# Altium schematic sheet cpu_io.SchDoc: CPU I/O and Configuration
size B; Engineer: Michael J. Kelly; Organization: CSB540otn - Outernet; Address1: AM335x Compute Board; Address2: (C) 2015; Address3: See us on the Web:; Address4: http://outernet.is; DocumentNumber: 4; Revision: V1.0; SheetNumber: 4; SheetTotal: 9
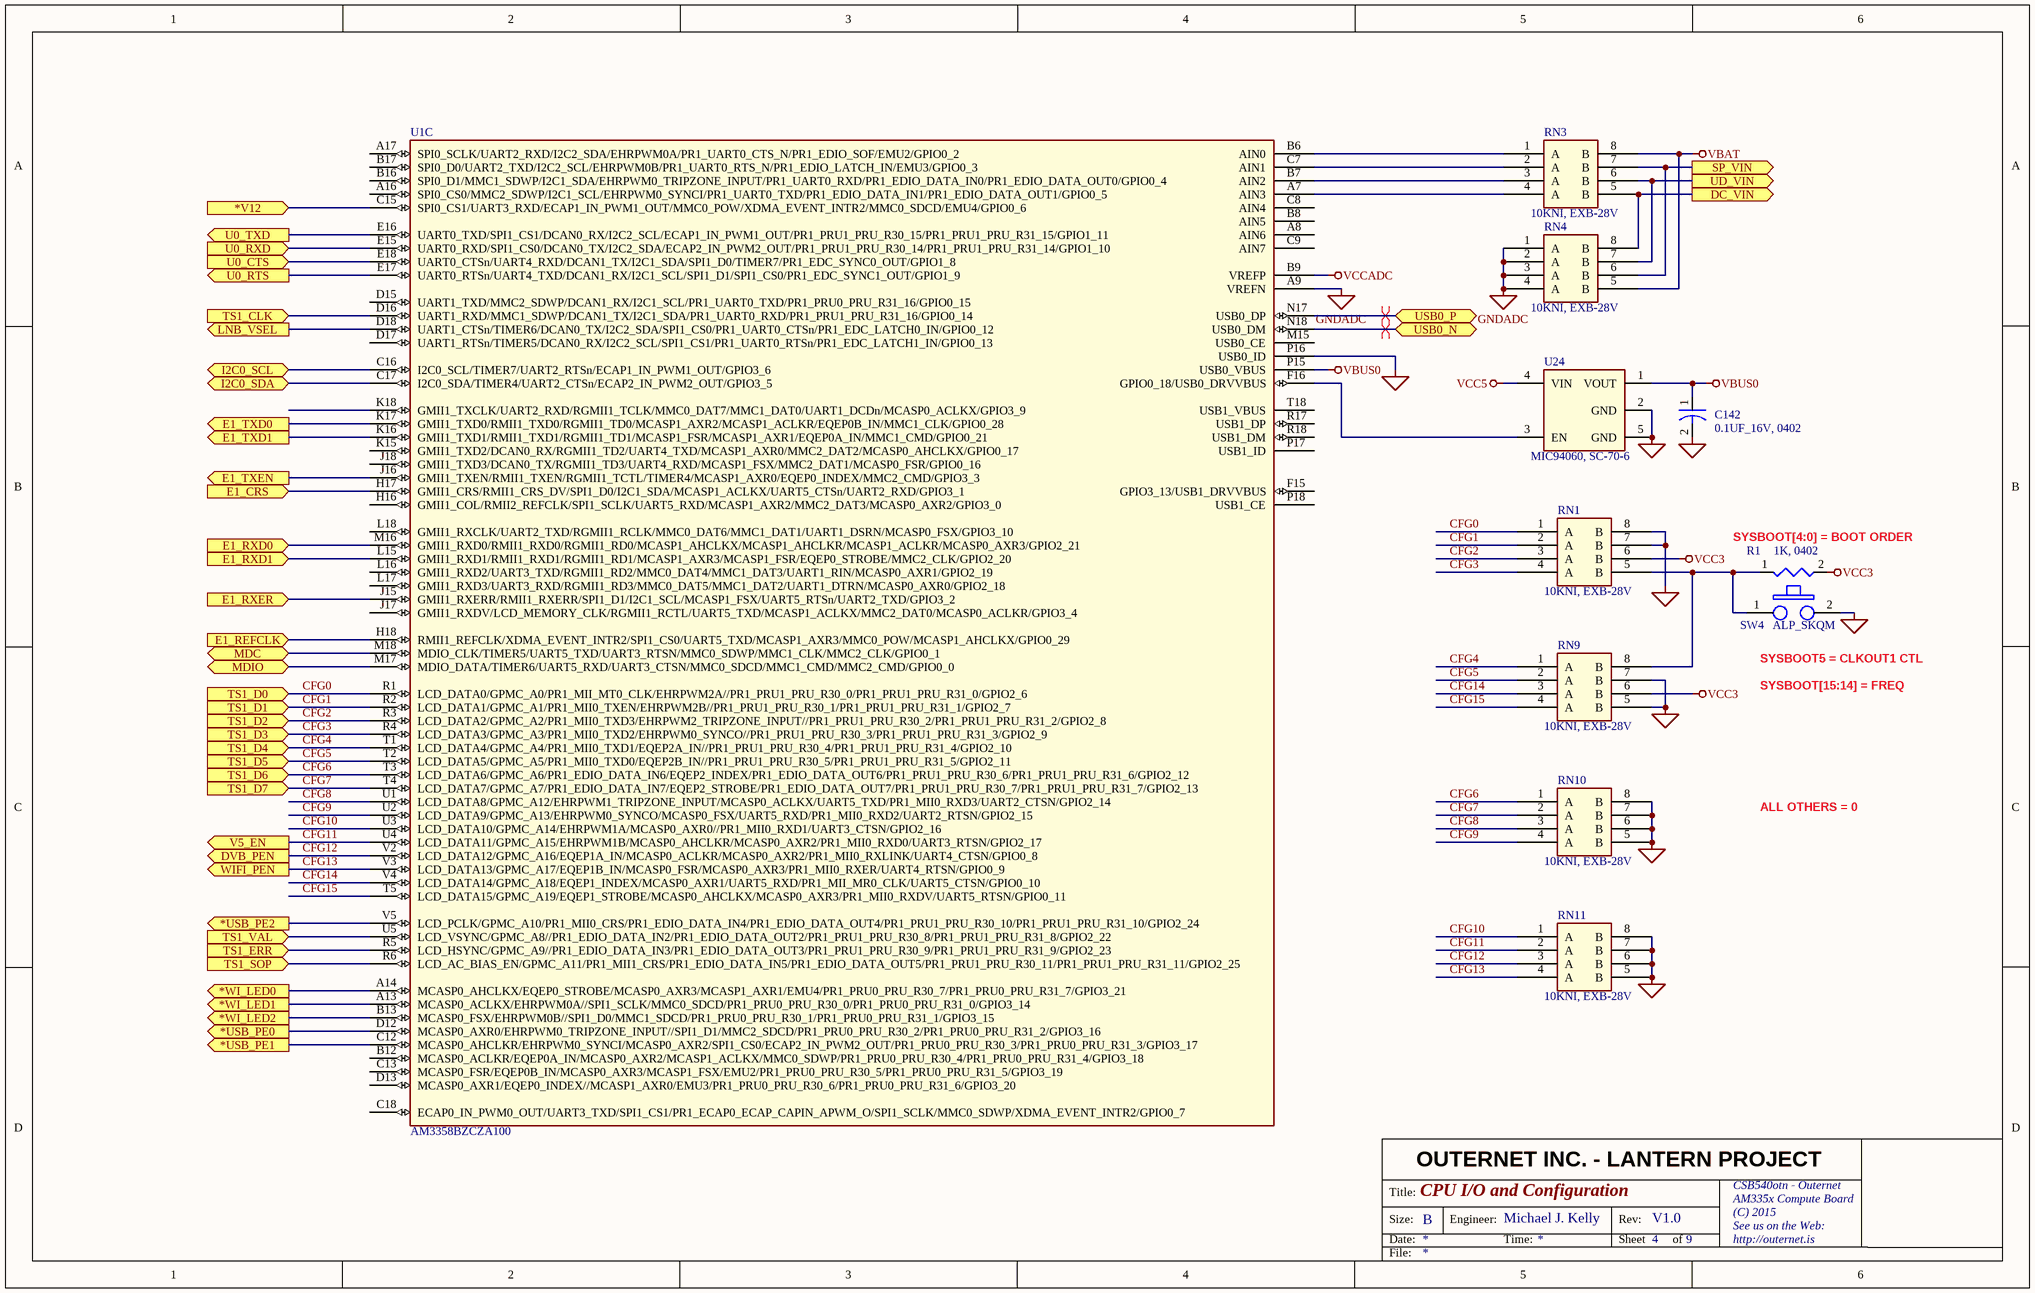
[diagram p0: cpu_io.SchDoc]

## Parts
C142  0.1UF_16V, 0402  [0402C]
R1  1K, 0402  [0402R]
RN1  10KNI, EXB-28V  [EXB-28V]
RN3  10KNI, EXB-28V  [EXB-28V]
RN4  10KNI, EXB-28V  [EXB-28V]
RN9  10KNI, EXB-28V  [EXB-28V]
RN10  10KNI, EXB-28V  [EXB-28V]
RN11  10KNI, EXB-28V  [EXB-28V]
SW4  ALP_SKQM  [ALPS_SKQM]
U1  AM3358BZCZA100  [BGA324x18]  (part C of 4)
U24  MIC94060, SC-70-6  [SOT-363/SC-70-6]

## Ports
*USB_PE0 (out), *USB_PE1 (out), *USB_PE2 (out), *V12 (in), *WI_LED0 (out), *WI_LED1 (out), *WI_LED2 (out), DC_VIN (out), DVB_PEN (out), E1_CRS (in), E1_REFCLK (in), E1_RXD0 (in), E1_RXD1 (in), E1_RXER (in), E1_TXD0 (out), E1_TXD1 (out), E1_TXEN (out), I2C0_SCL (bidir), I2C0_SDA (bidir), LNB_VSEL (out), MDC (bidir), MDIO (bidir), SP_VIN (out), TS1_CLK (in), TS1_D0 (in), TS1_D1 (in), TS1_D2 (in), TS1_D3 (in), TS1_D4 (in), TS1_D5 (in), TS1_D6 (in), TS1_D7 (in), TS1_ERR (in), TS1_SOP (in), TS1_VAL (in), U0_CTS (in), U0_RTS (out), U0_RXD (in), U0_TXD (out), UD_VIN (out), USB0_N (bidir), USB0_P (bidir), V5_EN (out), WIFI_PEN (out)

## Nets
GND: C142.2 RN1.7(B) RN1.8(B) RN9.5(B) RN9.7(B) RN10.5(B) RN10.6(B) RN10.7(B) RN10.8(B) RN11.5(B) RN11.6(B) RN11.7(B) RN11.8(B) SW4.2 U1.P16(USB0_ID) U24.2(GND) U24.5(GND)
GNDADC: RN4.1(A) RN4.2(A) RN4.3(A) RN4.4(A) U1.A9(VREFN)
VBAT: RN3.8(B) RN4.5(B)
VBUS0: C142.1 U1.P15(USB0_VBUS) U24.1(VOUT)
VCC3: R1.2 RN1.6(B) RN9.6(B)
VCC5: U24.4(VIN)
VCCADC: U1.B9(VREFP)
*USB_PE0: U1.D12(MCASP0_AXR0/EHRPWM0_TRIPZONE_INPUT//SPI1_D1/MMC2_SDCD/PR1_PRU0_PRU_R30_2/PR1_PRU0_PRU_R31_2/GPIO3_16) ; port *USB_PE0
*USB_PE1: U1.C12(MCASP0_AHCLKR/EHRPWM0_SYNCI/MCASP0_AXR2/SPI1_CS0/ECAP2_IN_PWM2_OUT/PR1_PRU0_PRU_R30_3/PR1_PRU0_PRU_R31_3/GPIO3_17) ; port *USB_PE1
*USB_PE2: U1.V5(LCD_PCLK/GPMC_A10/PR1_MII0_CRS/PR1_EDIO_DATA_IN4/PR1_EDIO_DATA_OUT4/PR1_PRU1_PRU_R30_10/PR1_PRU1_PRU_R31_10/GPIO2_24) ; port *USB_PE2
*V12: U1.C15(SPI0_CS1/UART3_RXD/ECAP1_IN_PWM1_OUT/MMC0_POW/XDMA_EVENT_INTR2/MMC0_SDCD/EMU4/GPIO0_6) ; port *V12
*WI_LED0: U1.A14(MCASP0_AHCLKX/EQEP0_STROBE/MCASP0_AXR3/MCASP1_AXR1/EMU4/PR1_PRU0_PRU_R30_7/PR1_PRU0_PRU_R31_7/GPIO3_21) ; port *WI_LED0
*WI_LED1: U1.A13(MCASP0_ACLKX/EHRPWM0A//SPI1_SCLK/MMC0_SDCD/PR1_PRU0_PRU_R30_0/PR1_PRU0_PRU_R31_0/GPIO3_14) ; port *WI_LED1
*WI_LED2: U1.B13(MCASP0_FSX/EHRPWM0B//SPI1_D0/MMC1_SDCD/PR1_PRU0_PRU_R30_1/PR1_PRU0_PRU_R31_1/GPIO3_15) ; port *WI_LED2
CFG0: RN1.1(A) U1.R1(LCD_DATA0/GPMC_A0/PR1_MII_MT0_CLK/EHRPWM2A//PR1_PRU1_PRU_R30_0/PR1_PRU1_PRU_R31_0/GPIO2_6) ; port TS1_D0
CFG1: RN1.2(A) U1.R2(LCD_DATA1/GPMC_A1/PR1_MII0_TXEN/EHRPWM2B//PR1_PRU1_PRU_R30_1/PR1_PRU1_PRU_R31_1/GPIO2_7) ; port TS1_D1
CFG2: RN1.3(A) U1.R3(LCD_DATA2/GPMC_A2/PR1_MII0_TXD3/EHRPWM2_TRIPZONE_INPUT//PR1_PRU1_PRU_R30_2/PR1_PRU1_PRU_R31_2/GPIO2_8) ; port TS1_D2
CFG3: RN1.4(A) U1.R4(LCD_DATA3/GPMC_A3/PR1_MII0_TXD2/EHRPWM0_SYNCO//PR1_PRU1_PRU_R30_3/PR1_PRU1_PRU_R31_3/GPIO2_9) ; port TS1_D3
CFG4: RN9.1(A) U1.T1(LCD_DATA4/GPMC_A4/PR1_MII0_TXD1/EQEP2A_IN//PR1_PRU1_PRU_R30_4/PR1_PRU1_PRU_R31_4/GPIO2_10) ; port TS1_D4
CFG5: RN9.2(A) U1.T2(LCD_DATA5/GPMC_A5/PR1_MII0_TXD0/EQEP2B_IN//PR1_PRU1_PRU_R30_5/PR1_PRU1_PRU_R31_5/GPIO2_11) ; port TS1_D5
CFG6: RN10.1(A) U1.T3(LCD_DATA6/GPMC_A6/PR1_EDIO_DATA_IN6/EQEP2_INDEX/PR1_EDIO_DATA_OUT6/PR1_PRU1_PRU_R30_6/PR1_PRU1_PRU_R31_6/GPIO2_12) ; port TS1_D6
CFG7: RN10.2(A) U1.T4(LCD_DATA7/GPMC_A7/PR1_EDIO_DATA_IN7/EQEP2_STROBE/PR1_EDIO_DATA_OUT7/PR1_PRU1_PRU_R30_7/PR1_PRU1_PRU_R31_7/GPIO2_13) ; port TS1_D7
CFG8: RN10.3(A) U1.U1(LCD_DATA8/GPMC_A12/EHRPWM1_TRIPZONE_INPUT/MCASP0_ACLKX/UART5_TXD/PR1_MII0_RXD3/UART2_CTSN/GPIO2_14)
CFG9: RN10.4(A) U1.U2(LCD_DATA9/GPMC_A13/EHRPWM0_SYNCO/MCASP0_FSX/UART5_RXD/PR1_MII0_RXD2/UART2_RTSN/GPIO2_15)
CFG10: RN11.1(A) U1.U3(LCD_DATA10/GPMC_A14/EHRPWM1A/MCASP0_AXR0//PR1_MII0_RXD1/UART3_CTSN/GPIO2_16)
CFG11: RN11.2(A) U1.U4(LCD_DATA11/GPMC_A15/EHRPWM1B/MCASP0_AHCLKR/MCASP0_AXR2/PR1_MII0_RXD0/UART3_RTSN/GPIO2_17) ; port V5_EN
CFG12: RN11.3(A) U1.V2(LCD_DATA12/GPMC_A16/EQEP1A_IN/MCASP0_ACLKR/MCASP0_AXR2/PR1_MII0_RXLINK/UART4_CTSN/GPIO0_8) ; port DVB_PEN
CFG13: RN11.4(A) U1.V3(LCD_DATA13/GPMC_A17/EQEP1B_IN/MCASP0_FSR/MCASP0_AXR3/PR1_MII0_RXER/UART4_RTSN/GPIO0_9) ; port WIFI_PEN
CFG14: RN9.3(A) U1.V4(LCD_DATA14/GPMC_A18/EQEP1_INDEX/MCASP0_AXR1/UART5_RXD/PR1_MII_MR0_CLK/UART5_CTSN/GPIO0_10)
CFG15: RN9.4(A) U1.T5(LCD_DATA15/GPMC_A19/EQEP1_STROBE/MCASP0_AHCLKX/MCASP0_AXR3/PR1_MII0_RXDV/UART5_RTSN/GPIO0_11)
DC_VIN: RN3.5(B) RN4.8(B) ; port DC_VIN
E1_CRS: U1.H17(GMII1_CRS/RMII1_CRS_DV/SPI1_D0/I2C1_SDA/MCASP1_ACLKX/UART5_CTSn/UART2_RXD/GPIO3_1) ; port E1_CRS
E1_REFCLK: U1.H18(RMII1_REFCLK/XDMA_EVENT_INTR2/SPI1_CS0/UART5_TXD/MCASP1_AXR3/MMC0_POW/MCASP1_AHCLKX/GPIO0_29) ; port E1_REFCLK
E1_RXD0: U1.M16(GMII1_RXD0/RMII1_RXD0/RGMII1_RD0/MCASP1_AHCLKX/MCASP1_AHCLKR/MCASP1_ACLKR/MCASP0_AXR3/GPIO2_21) ; port E1_RXD0
E1_RXD1: U1.L15(GMII1_RXD1/RMII1_RXD1/RGMII1_RD1/MCASP1_AXR3/MCASP1_FSR/EQEP0_STROBE/MMC2_CLK/GPIO2_20) ; port E1_RXD1
E1_RXER: U1.J15(GMII1_RXERR/RMII1_RXERR/SPI1_D1/I2C1_SCL/MCASP1_FSX/UART5_RTSn/UART2_TXD/GPIO3_2) ; port E1_RXER
E1_TXD0: U1.K17(GMII1_TXD0/RMII1_TXD0/RGMII1_TD0/MCASP1_AXR2/MCASP1_ACLKR/EQEP0B_IN/MMC1_CLK/GPIO0_28) ; port E1_TXD0
E1_TXD1: U1.K16(GMII1_TXD1/RMII1_TXD1/RGMII1_TD1/MCASP1_FSR/MCASP1_AXR1/EQEP0A_IN/MMC1_CMD/GPIO0_21) ; port E1_TXD1
E1_TXEN: U1.J16(GMII1_TXEN/RMII1_TXEN/RGMII1_TCTL/TIMER4/MCASP1_AXR0/EQEP0_INDEX/MMC2_CMD/GPIO3_3) ; port E1_TXEN
I2C0_SCL: U1.C16(I2C0_SCL/TIMER7/UART2_RTSn/ECAP1_IN_PWM1_OUT/GPIO3_6) ; port I2C0_SCL
I2C0_SDA: U1.C17(I2C0_SDA/TIMER4/UART2_CTSn/ECAP2_IN_PWM2_OUT/GPIO3_5) ; port I2C0_SDA
LNB_VSEL: U1.D18(UART1_CTSn/TIMER6/DCAN0_TX/I2C2_SDA/SPI1_CS0/PR1_UART0_CTSn/PR1_EDC_LATCH0_IN/GPIO0_12) ; port LNB_VSEL
MDC: U1.M18(MDIO_CLK/TIMER5/UART5_TXD/UART3_RTSN/MMC0_SDWP/MMC1_CLK/MMC2_CLK/GPIO0_1) ; port MDC
MDIO: U1.M17(MDIO_DATA/TIMER6/UART5_RXD/UART3_CTSN/MMC0_SDCD/MMC1_CMD/MMC2_CMD/GPIO0_0) ; port MDIO
SP_VIN: RN3.7(B) RN4.6(B) ; port SP_VIN
TS1_CLK: U1.D16(UART1_RXD/MMC1_SDWP/DCAN1_TX/I2C1_SDA/PR1_UART0_RXD/PR1_PRU1_PRU_R31_16/GPIO0_14) ; port TS1_CLK
TS1_ERR: U1.R5(LCD_HSYNC/GPMC_A9//PR1_EDIO_DATA_IN3/PR1_EDIO_DATA_OUT3/PR1_PRU1_PRU_R30_9/PR1_PRU1_PRU_R31_9/GPIO2_23) ; port TS1_ERR
TS1_SOP: U1.R6(LCD_AC_BIAS_EN/GPMC_A11/PR1_MII1_CRS/PR1_EDIO_DATA_IN5/PR1_EDIO_DATA_OUT5/PR1_PRU1_PRU_R30_11/PR1_PRU1_PRU_R31_11/GPIO2_25) ; port TS1_SOP
TS1_VAL: U1.U5(LCD_VSYNC/GPMC_A8//PR1_EDIO_DATA_IN2/PR1_EDIO_DATA_OUT2/PR1_PRU1_PRU_R30_8/PR1_PRU1_PRU_R31_8/GPIO2_22) ; port TS1_VAL
U0_CTS: U1.E18(UART0_CTSn/UART4_RXD/DCAN1_TX/I2C1_SDA/SPI1_D0/TIMER7/PR1_EDC_SYNC0_OUT/GPIO1_8) ; port U0_CTS
U0_RTS: U1.E17(UART0_RTSn/UART4_TXD/DCAN1_RX/I2C1_SCL/SPI1_D1/SPI1_CS0/PR1_EDC_SYNC1_OUT/GPIO1_9) ; port U0_RTS
U0_RXD: U1.E15(UART0_RXD/SPI1_CS0/DCAN0_TX/I2C2_SDA/ECAP2_IN_PWM2_OUT/PR1_PRU1_PRU_R30_14/PR1_PRU1_PRU_R31_14/GPIO1_10) ; port U0_RXD
U0_TXD: U1.E16(UART0_TXD/SPI1_CS1/DCAN0_RX/I2C2_SCL/ECAP1_IN_PWM1_OUT/PR1_PRU1_PRU_R30_15/PR1_PRU1_PRU_R31_15/GPIO1_11) ; port U0_TXD
UD_VIN: RN3.6(B) RN4.7(B) ; port UD_VIN
USB0_N: U1.N18(USB0_DM) ; port USB0_N
USB0_P: U1.N17(USB0_DP) ; port USB0_P
NetR1_1: R1.1 RN1.5(B) RN9.8(B) SW4.1
NetRN3_1: RN3.1(A) U1.B6(AIN0)
NetRN3_2: RN3.2(A) U1.C7(AIN1)
NetRN3_3: RN3.3(A) U1.B7(AIN2)
NetRN3_4: RN3.4(A) U1.A7(AIN3)
NetU1_F16: U1.F16(GPIO0_18/USB0_DRVVBUS) U24.3(EN)

Not connected (* = marked no-connect by the designer): U1 A8(AIN6) A16(SPI0_CS0/MMC2_SDWP/I2C1_SCL/EHRPWM0_SYNCI/PR1_UART0_TXD/PR1_EDIO_DATA_IN1/PR1_EDIO_DATA_OUT1/GPIO0_5) A17(SPI0_SCLK/UART2_RXD/I2C2_SDA/EHRPWM0A/PR1_UART0_CTS_N/PR1_EDIO_SOF/EMU2/GPIO0_2) B8(AIN5) B12(MCASP0_ACLKR/EQEP0A_IN/MCASP0_AXR2/MCASP1_ACLKX/MMC0_SDWP/PR1_PRU0_PRU_R30_4/PR1_PRU0_PRU_R31_4/GPIO3_18) B16(SPI0_D1/MMC1_SDWP/I2C1_SDA/EHRPWM0_TRIPZONE_INPUT/PR1_UART0_RXD/PR1_EDIO_DATA_IN0/PR1_EDIO_DATA_OUT0/GPIO0_4) B17(SPI0_D0/UART2_TXD/I2C2_SCL/EHRPWM0B/PR1_UART0_RTS_N/PR1_EDIO_LATCH_IN/EMU3/GPIO0_3) C8(AIN4) C9(AIN7) C13(MCASP0_FSR/EQEP0B_IN/MCASP0_AXR3/MCASP1_FSX/EMU2/PR1_PRU0_PRU_R30_5/PR1_PRU0_PRU_R31_5/GPIO3_19) C18(ECAP0_IN_PWM0_OUT/UART3_TXD/SPI1_CS1/PR1_ECAP0_ECAP_CAPIN_APWM_O/SPI1_SCLK/MMC0_SDWP/XDMA_EVENT_INTR2/GPIO0_7) D13(MCASP0_AXR1/EQEP0_INDEX//MCASP1_AXR0/EMU3/PR1_PRU0_PRU_R30_6/PR1_PRU0_PRU_R31_6/GPIO3_20) D15(UART1_TXD/MMC2_SDWP/DCAN1_RX/I2C1_SCL/PR1_UART0_TXD/PR1_PRU0_PRU_R31_16/GPIO0_15) D17(UART1_RTSn/TIMER5/DCAN0_RX/I2C2_SCL/SPI1_CS1/PR1_UART0_RTSn/PR1_EDC_LATCH1_IN/GPIO0_13) F15(GPIO3_13/USB1_DRVVBUS) H16(GMII1_COL/RMII2_REFCLK/SPI1_SCLK/UART5_RXD/MCASP1_AXR2/MMC2_DAT3/MCASP0_AXR2/GPIO3_0) J17(GMII1_RXDV/LCD_MEMORY_CLK/RGMII1_RCTL/UART5_TXD/MCASP1_ACLKX/MMC2_DAT0/MCASP0_ACLKR/GPIO3_4) J18(GMII1_TXD3/DCAN0_TX/RGMII1_TD3/UART4_RXD/MCASP1_FSX/MMC2_DAT1/MCASP0_FSR/GPIO0_16) K15(GMII1_TXD2/DCAN0_RX/RGMII1_TD2/UART4_TXD/MCASP1_AXR0/MMC2_DAT2/MCASP0_AHCLKX/GPIO0_17) K18(GMII1_TXCLK/UART2_RXD/RGMII1_TCLK/MMC0_DAT7/MMC1_DAT0/UART1_DCDn/MCASP0_ACLKX/GPIO3_9) L16(GMII1_RXD2/UART3_TXD/RGMII1_RD2/MMC0_DAT4/MMC1_DAT3/UART1_RIN/MCASP0_AXR1/GPIO2_19) L17(GMII1_RXD3/UART3_RXD/RGMII1_RD3/MMC0_DAT5/MMC1_DAT2/UART1_DTRN/MCASP0_AXR0/GPIO2_18) L18(GMII1_RXCLK/UART2_TXD/RGMII1_RCLK/MMC0_DAT6/MMC1_DAT1/UART1_DSRN/MCASP0_FSX/GPIO3_10) M15(USB0_CE) P17(USB1_ID) P18(USB1_CE) R17(USB1_DP) R18(USB1_DM) T18(USB1_VBUS)

## Layout directives
differential pair: USB0_N, USB0_P

## Notes on the sheet
- (near R1) SYSBOOT[4:0] = BOOT ORDER
- (near SW4) SYSBOOT5 = CLKOUT1 CTL
- SYSBOOT[15:14] = FREQ
- ALL OTHERS = 0
- OUTERNET INC. - LANTERN PROJECT
- Title:
- Size:
- Date:
- B
- Engineer:
- Time:
- Rev:
- Sheet
- of
- File:

## Library data of the parts
C142 = 0.1UF_16V, 0402: CAP - 0402 PKG
R1 = 1K, 0402: RES - 0402 PKG
RN1 RN3 RN4 RN9-RN11 = 10KNI, EXB-28V: RES NET, 4 INDIVIDUAL, EXB-28V
SW4 = ALP_SKQM: SWITCH - PUSHBUTTON SMT, 6MM X 3.5MM
U1 = AM3358BZCZA100: MPU - CORTEX-A8 CORE, SDIO, GIGe, USB x2, UART x3, CAN, 2D/3D
U24 = MIC94060, SC-70-6: IC - POWER SWITCH, 1.7V - 5.5V @ 2A, HIGH TRUE